# EAGLE design Throwing_POW_Supply (EAGLE 8.5.1)
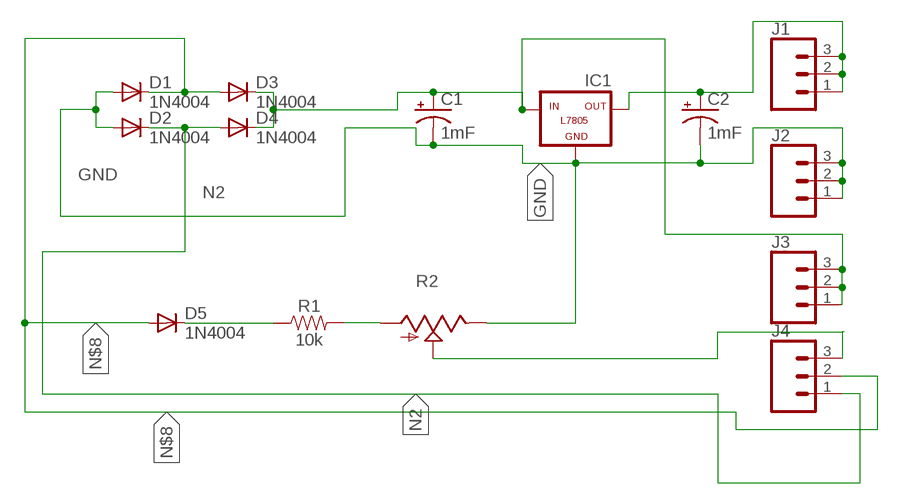
[diagram p0: schematic, sheet 1]

## Parts
C1  1mF  1000UF-RADIAL-5MM-25V-20%  [CPOL-RADIAL-5MM-10MM]
C2  1mF  1000UF-RADIAL-5MM-25V-20%  [CPOL-RADIAL-5MM-10MM]
D1  1N4004  [DO41-10]
D2  1N4004  [DO41-10]
D3  1N4004  [DO41-10]
D4  1N4004  [DO41-10]
D5  1N4004  [DO41-10]
IC1  L7805  [78XXL]
J1  CONN_03  [1X03]
J2  CONN_03  [1X03]
J3  CONN_03  [1X03]
J4  CONN_03  [1X03]
R1  10k  10KOHM-HORIZ-1/4W-1%  [AXIAL-0.3]
R2  TRIM_US-B25P  [B25P]

## Nets
GND: C1.- C2.- D1.A D2.A IC1.GND J2.1 J2.2 J2.3 R2.E
N2: D2.C D4.A J4.1
N$3: C2.+ IC1.OUT J1.1 J1.2 J1.3
N$4: D5.C R1.P$1
N$5: R1.P$2 R2.A
N$6: C1.+ D3.C D4.C IC1.IN J3.1 J3.2 J3.3
N$7: J4.3 R2.S
N$8: D1.C D3.A D5.A J4.2

## Library data of the parts
C1 C2 = SparkFun-Capacitors:1000UF: 1,000µF/1mF ceramic capacitors A capacitor is a passive two-terminal electrical component used to store electrical energy temporarily in an electric field. CAP-08070; PROD_ID: CAP-09538
D1-D5 = adafruit:1N4004: DIODE General purpose 1N400x type rectifier (With bigger pads) http://www.ladyada.net/library/pcb/eaglelibrary.html
IC1 = tango:L7805: VOLTAGE REGULATOR
J1-J4 = SparkFun-Connectors:CONN_03: Multi connection point. Often used as Generic Header-pin footprint for 0.1 inch spaced/style header connections On any of the 0.1 inch spaced packages, you can populate with these: Break Away Headers - Straight <https://www.sparkfun.com/products/116> (PRT-00116) Break Away Male Headers - Right Angle <https://www.sparkfun.com/products/553> (PRT-00553) Female Headers <https://www.sparkfun.com/products/115> (PRT-00115) Break Away Headers - Machine Pin <https://www.sparkfun.com/products/117> (PRT-00117) Break Away Female Headers - Swiss Machine Pin <https://www.sparkfun.com/products/743> (PRT-00743) Stackable Header - 3 Pin (Female, 0.1") <https://www.sparkfun.com/products/13875> (PRT-13875) For SCREWTERMINALS and SPRING TERMINALS visit here: Screw Terimnals on SparkFun.com <https://www.sparkfun.com/search/results?term=Screw+Terminals> (5mm/3.5mm/2.54mm spacing) This device is also useful as a general connection point to wire up your design to another part of your project. Our various solder wires solder well into these plated through hole pads. Hook-Up Wire - Assortment (Stranded, 22 AWG) <https://www.sparkfun.com/products/11375> (PRT-11375) Hook-Up Wire - Assortment (Solid Core, 22 AWG) <https://www.sparkfun.com/products/11367> (PRT-11367) View the entire wire category on our website here <https://www.sparkfun.com/categories/141> Special notes: Molex polarized connector foot print use with SKU : PRT-08232 with associated crimp pins and housings.
R1 = SparkFun-Resistors:10KOHM: 10kΩ resistor A resistor is a passive two-terminal electrical component that implements electrical resistance as a circuit element. Resistors act to reduce current flow, and, at the same time, act to lower voltage levels within circuits. - Wikipedia; PROD_ID: RES-12183
R2 = pot:TRIM_US-: POTENTIOMETER

## Net classes
0 default: width 1 mm, drill 1 mm, clearance 0.8 mm

## Board
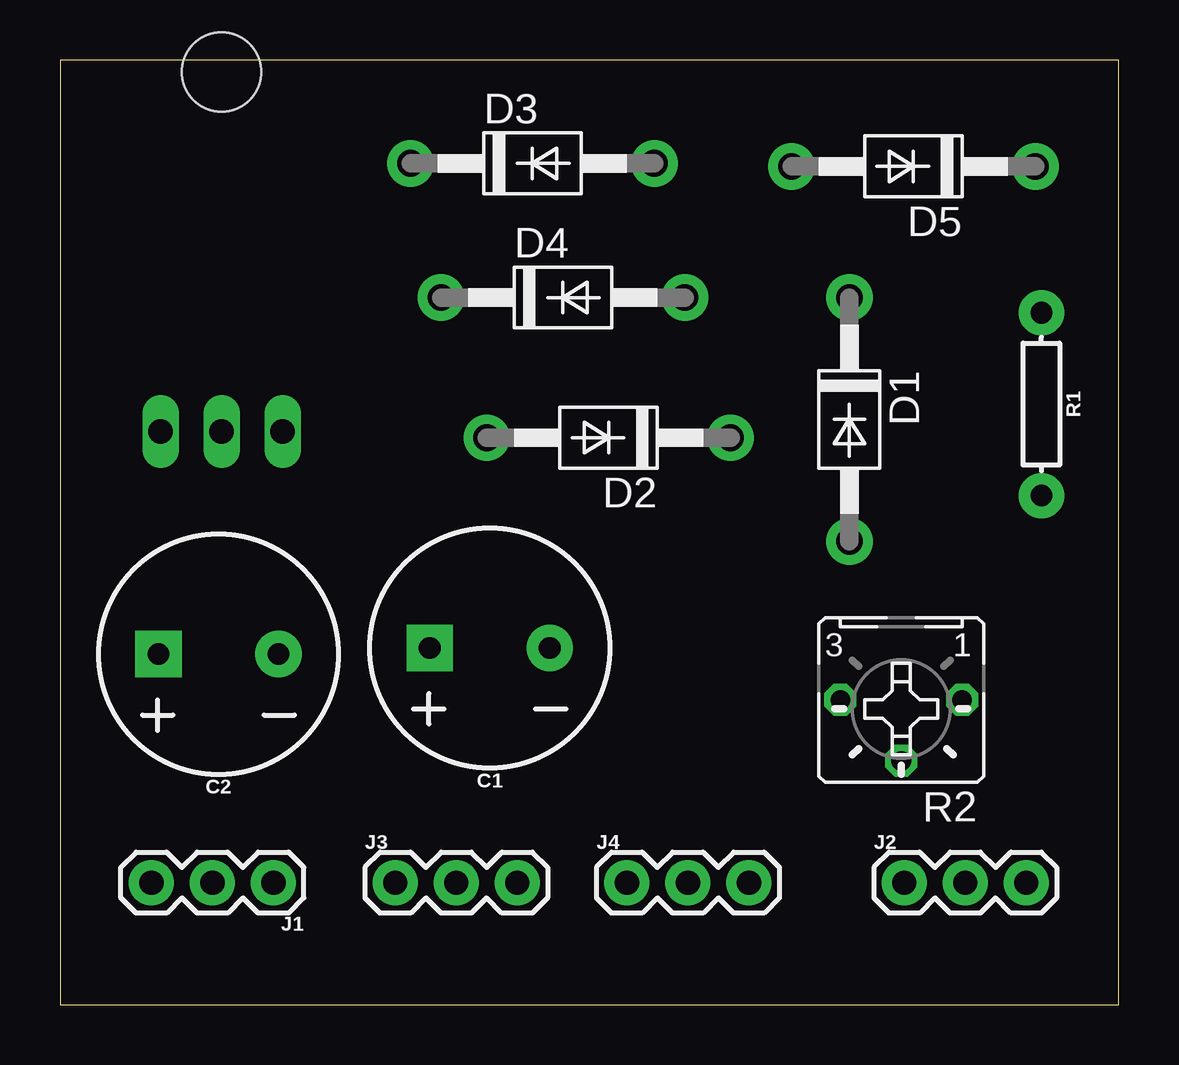
[diagram p1: board, top side]
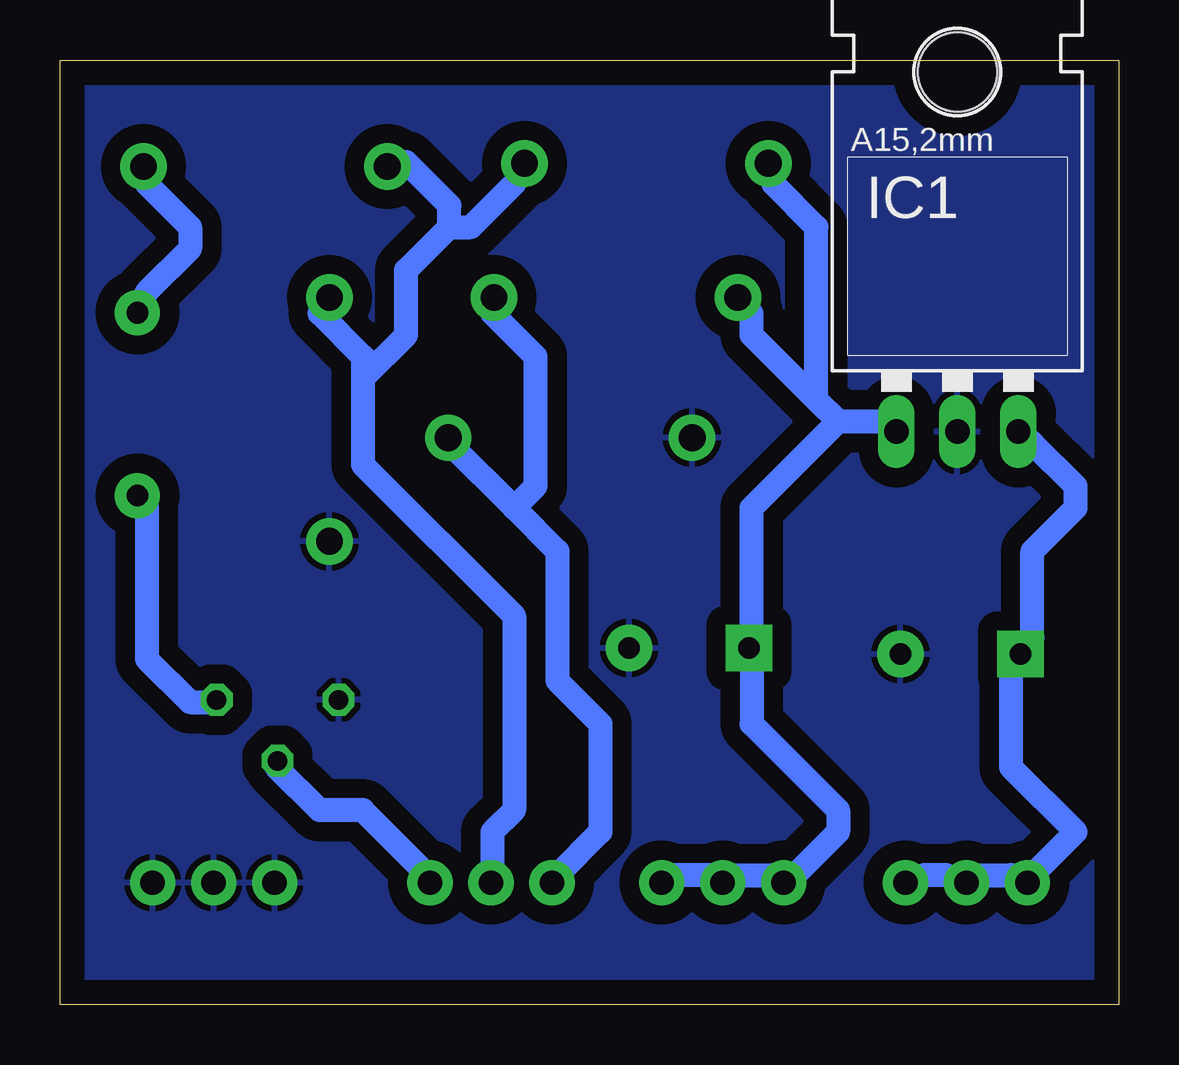
[diagram p2: board, bottom side, seen from below]

Size 44.12 x 39.36 mm. Coordinates in mm from the lower left corner, seen from the top.
Outline: 0,0 44.12,0 44.12,39.36 0,39.36 0,0
Copper layers (1*16): Top 0.035mm / dielectric 1.5mm / Bottom 0.035mm
Design rules "default": minimum track width 6mil, minimum drill 0.35mm, track to track 6mil, track to pad 6mil, pad to pad 6mil, via to via 6mil, smd to smd 6mil, copper to edge 40mil, drill to drill 6mil, minimum pad ring 10mil, minimum via ring 8mil, stop-mask expansion 4mil, vias tented up to drill 0mil, thermal gap 10mil

### Footprints (pad centres in the part's own frame; a part is rotated, then mirrored left to right if it is on the bottom)
CPOL-RADIAL-5MM-10MM = drill 0.9 pad 1.93 square: + 2.5,0 | drill 0.9 pad 1.93: - -2.5,0
DO41-10 = drill 1.118 pad 1.93: A 5.08,0; C -5.08,0
78XXL = drill 1.016 long: GND 0,-3.81; IN -2.54,-3.81; OUT 2.54,-3.81 | hole 3.302: 0,11.176
1X03 = drill 1.016 pad 1.88: 1 0,0; 2 2.54,0; 3 5.08,0
AXIAL-0.3 = drill 0.9 pad 1.88: P$1 -3.81,0; P$2 3.81,0
B25P = drill 0.813 octagon: A -2.54,0; E 2.54,0; S 0,2.54

### Placement (x,y rotation side)
C1  17.91,14.86 180 top
C2  6.6,14.61 180 top
D1  32.89,24.38 270 top
D2  22.86,23.62 180 top
D3  19.68,35.05 0 top
D4  20.95,29.46 0 top
D5  35.56,34.92 180 top
IC1  6.73,27.69 0 bottom
J1  8.89,5.08 180 top
J2  35.18,5.08 0 top
J3  13.97,5.08 0 top
J4  23.62,5.08 0 top
R1  40.89,25.02 270 top
R2  35.05,12.7 180 top

### Tracks (layer width: path | path; a pad name or v marks a point on that pad's centre or on a via)
GND
  pour Bottom: -1.27,57.15 43.18,57.15 43.18,0 0,0 -1.27,-1.27
N2
  Bottom 1: 25.2,20.7 27.9,23.4 D2.C | 25.2,20.7 23.4,18.9 23.4,13.5 21.6,11.7 21.6,7.2 23.4,5.4 J4.1 | 25.2,20.7 24.3,21.6 24.3,27 26.1,28.8 D4.A
N$3
  Bottom 1: J1.1 8.1,5.4 7.2,5.4 J1.2 6.3,5.4 4.5,5.4 J1.3 3.6,5.4 1.8,7.2 4.5,9.9 4.5,14.4 C2.+ 3.6,15.3 3.6,18.9 1.8,20.7 1.8,21.6 3.6,23.4 IC1.OUT
N$4
  Bottom 1: R1.P$1 40.5,29.7 38.7,31.5 38.7,32.4 40.5,34.2 D5.C
N$5
  Bottom 1: R2.A 37.8,12.6 38.7,12.6 40.5,14.4 40.5,20.7 R1.P$2
N$6
  Bottom 1: J3.3 18.9,5.4 17.1,5.4 J3.2 16.2,5.4 14.4,5.4 J3.1 13.5,5.4 11.7,7.2 11.7,8.1 15.3,11.7 15.3,14.4 C1.+ 15.3,15.3 15.3,20.7 11.7,24.3 | 11.7,24.3 9.9,24.3 IC1.IN | 12.6,25.2 12.6,32.4 14.4,34.2 D3.C | 11.7,24.3 12.6,25.2 | 12.6,25.2 15.3,27.9 15.3,28.8 D4.C
N$7
  Bottom 1: R2.S 35.1,9.9 33.3,8.1 31.5,8.1 28.8,5.4 J4.3
N$8
  Bottom 1: 31.5,26.1 31.5,27 33.3,28.8 D1.C | 31.5,26.1 31.5,22.5 25.2,16.2 25.2,8.1 26.1,7.2 26.1,5.4 J4.2 | 27.9,32.4 27.9,33.3 29.7,35.1 D5.A | 27.9,32.4 29.7,30.6 29.7,27.9 31.5,26.1 | 27.9,32.4 27,32.4 25.2,34.2 D3.A